# EAGLE schematic switch_fan (EAGLE 7.1.0)
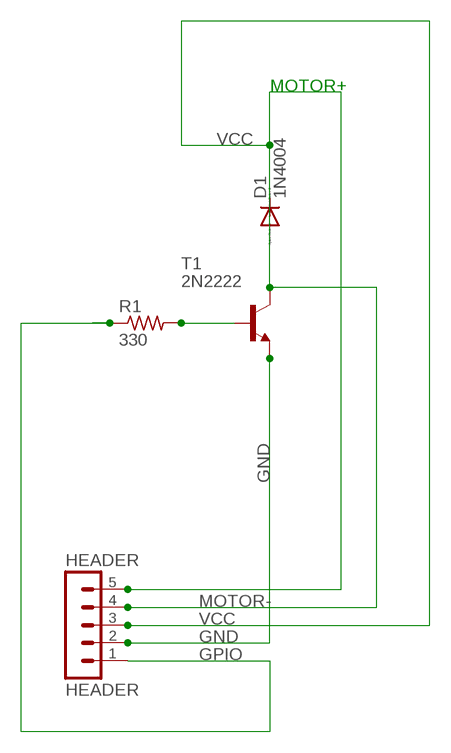
[diagram p0: schematic, sheet 1]

## Parts
D1  1N4004  [DO41-10]
HEADER  HEADER  MA05-1  [MA05-1]
R1  330  R-US_0207/10  [0207/10]
T1  2N2222  [TO18]

## Nets
GND: HEADER.2 T1.1(E)
GPIO: HEADER.1 R1.1
MOTOR-: HEADER.4 T1.3(C)
N$1: R1.2 T1.2(B)
VCC: D1.A D1.C HEADER.3 HEADER.5

## Notes on the sheet
- MOTOR+

## Library data of the parts
D1 = diode:1N4004: DIODE general purpose rectifier, 1 A
HEADER = con-lstb:MA05-1: PIN HEADER; OC_FARNELL: unknown; OC_NEWARK: unknown
R1 = rcl:R-US_: RESISTOR, American symbol
T1 = transistor:2N2222: NPN TRANSISTOR